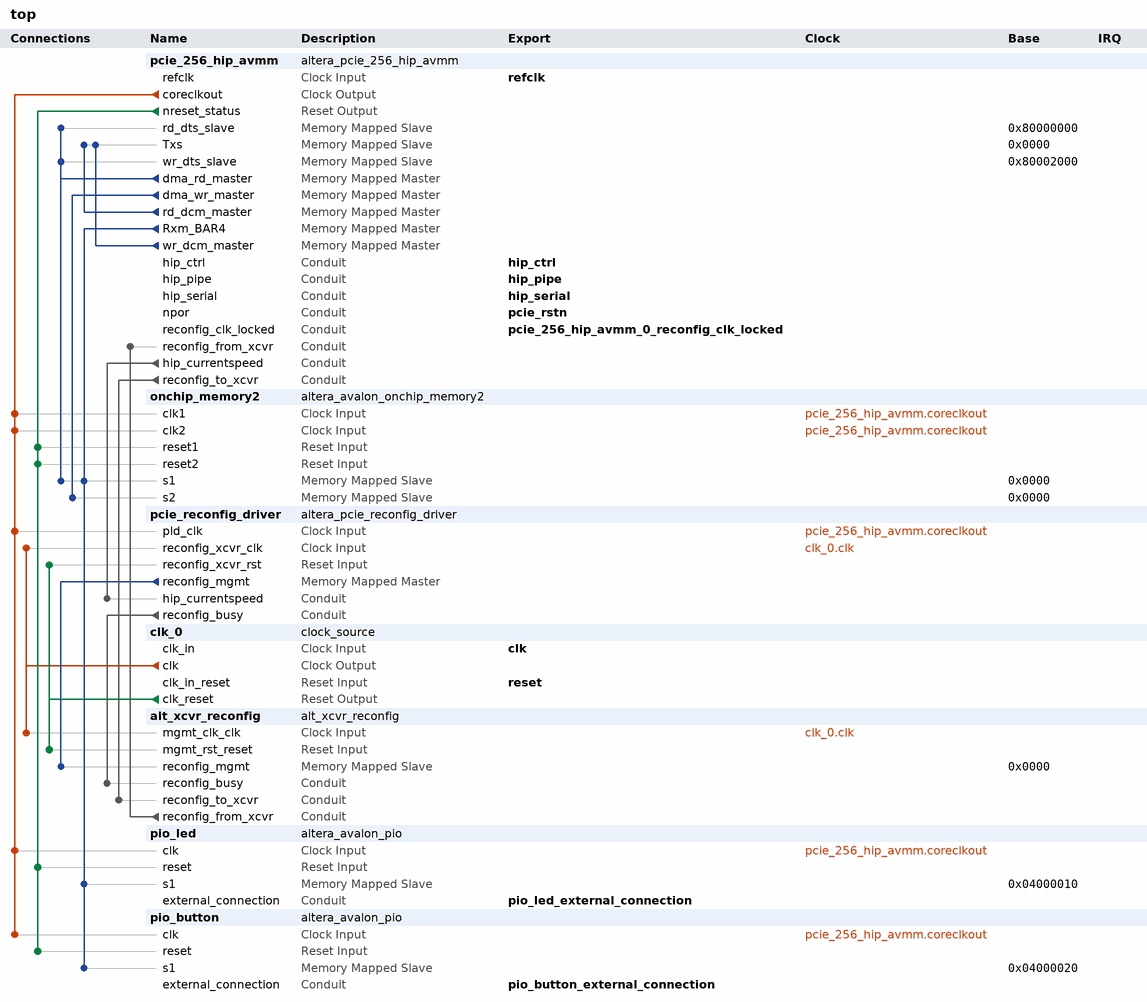
[diagram p0: system contents]
# Platform Designer (Qsys) system top, Cyclone V 5CGTFD9D5F27C7
# Parameters at their usual value, and those the tool derives, are not listed.
package require -exact qsys 17.1
create_system top
set_project_property DEVICE_FAMILY {Cyclone V}
set_project_property DEVICE 5CGTFD9D5F27C7

add_instance pcie_256_hip_avmm altera_pcie_256_hip_avmm 17.1
set_instance_parameter_value pcie_256_hip_avmm CB_P2A_AVALON_ADDR_B0 0x00000000
set_instance_parameter_value pcie_256_hip_avmm CB_P2A_AVALON_ADDR_B1 0x00000000
set_instance_parameter_value pcie_256_hip_avmm CB_P2A_AVALON_ADDR_B2 0x00000000
set_instance_parameter_value pcie_256_hip_avmm CB_P2A_AVALON_ADDR_B3 0x00000000
set_instance_parameter_value pcie_256_hip_avmm CB_P2A_AVALON_ADDR_B4 0x00000000
set_instance_parameter_value pcie_256_hip_avmm CB_P2A_AVALON_ADDR_B5 0x00000000
set_instance_parameter_value pcie_256_hip_avmm CB_P2A_FIXED_AVALON_ADDR_B0 0
set_instance_parameter_value pcie_256_hip_avmm CB_P2A_FIXED_AVALON_ADDR_B1 0
set_instance_parameter_value pcie_256_hip_avmm CB_P2A_FIXED_AVALON_ADDR_B2 0
set_instance_parameter_value pcie_256_hip_avmm CB_P2A_FIXED_AVALON_ADDR_B3 0
set_instance_parameter_value pcie_256_hip_avmm CB_P2A_FIXED_AVALON_ADDR_B4 0
set_instance_parameter_value pcie_256_hip_avmm CB_P2A_FIXED_AVALON_ADDR_B5 0
set_instance_parameter_value pcie_256_hip_avmm CG_COMMON_CLOCK_MODE 1
set_instance_parameter_value pcie_256_hip_avmm CG_RXM_IRQ_NUM 16
set_instance_parameter_value pcie_256_hip_avmm NUM_PREFETCH_MASTERS 1
set_instance_parameter_value pcie_256_hip_avmm RD_SLAVE_ADDRESS_MAP 32
set_instance_parameter_value pcie_256_hip_avmm SLAVE_ADDRESS_MAP_0 0
set_instance_parameter_value pcie_256_hip_avmm SLAVE_ADDRESS_MAP_1 0
set_instance_parameter_value pcie_256_hip_avmm SLAVE_ADDRESS_MAP_2 0
set_instance_parameter_value pcie_256_hip_avmm SLAVE_ADDRESS_MAP_3 0
set_instance_parameter_value pcie_256_hip_avmm SLAVE_ADDRESS_MAP_4 27
set_instance_parameter_value pcie_256_hip_avmm SLAVE_ADDRESS_MAP_5 0
set_instance_parameter_value pcie_256_hip_avmm TX_S_ADDR_WIDTH 64
set_instance_parameter_value pcie_256_hip_avmm WR_SLAVE_ADDRESS_MAP 19
set_instance_parameter_value pcie_256_hip_avmm add_pll_to_hip_coreclkout 0
set_instance_parameter_value pcie_256_hip_avmm advanced_default_hwtcl_atomic_malformed true
set_instance_parameter_value pcie_256_hip_avmm advanced_default_hwtcl_atomic_op_completer_32bit false
set_instance_parameter_value pcie_256_hip_avmm advanced_default_hwtcl_atomic_op_completer_64bit false
set_instance_parameter_value pcie_256_hip_avmm advanced_default_hwtcl_atomic_op_routing false
set_instance_parameter_value pcie_256_hip_avmm advanced_default_hwtcl_bridge_port_ssid_support false
set_instance_parameter_value pcie_256_hip_avmm advanced_default_hwtcl_bridge_port_vga_enable false
set_instance_parameter_value pcie_256_hip_avmm advanced_default_hwtcl_bypass_cdc false
set_instance_parameter_value pcie_256_hip_avmm advanced_default_hwtcl_cas_completer_128bit false
set_instance_parameter_value pcie_256_hip_avmm advanced_default_hwtcl_cdc_dummy_insert_limit 11
set_instance_parameter_value pcie_256_hip_avmm advanced_default_hwtcl_d0_pme false
set_instance_parameter_value pcie_256_hip_avmm advanced_default_hwtcl_d1_pme false
set_instance_parameter_value pcie_256_hip_avmm advanced_default_hwtcl_d1_support false
set_instance_parameter_value pcie_256_hip_avmm advanced_default_hwtcl_d2_pme false
set_instance_parameter_value pcie_256_hip_avmm advanced_default_hwtcl_d2_support false
set_instance_parameter_value pcie_256_hip_avmm advanced_default_hwtcl_d3_cold_pme false
set_instance_parameter_value pcie_256_hip_avmm advanced_default_hwtcl_d3_hot_pme false
set_instance_parameter_value pcie_256_hip_avmm advanced_default_hwtcl_data_pack_rx disable
set_instance_parameter_value pcie_256_hip_avmm advanced_default_hwtcl_deskew_comma com_deskw
set_instance_parameter_value pcie_256_hip_avmm advanced_default_hwtcl_device_number 0
set_instance_parameter_value pcie_256_hip_avmm advanced_default_hwtcl_disable_link_x2_support false
set_instance_parameter_value pcie_256_hip_avmm advanced_default_hwtcl_disable_snoop_packet false
set_instance_parameter_value pcie_256_hip_avmm advanced_default_hwtcl_ei_delay_powerdown_count 10
set_instance_parameter_value pcie_256_hip_avmm advanced_default_hwtcl_eie_before_nfts_count 4
set_instance_parameter_value pcie_256_hip_avmm advanced_default_hwtcl_enable_adapter_half_rate_mode false
set_instance_parameter_value pcie_256_hip_avmm advanced_default_hwtcl_enable_l1_aspm false
set_instance_parameter_value pcie_256_hip_avmm advanced_default_hwtcl_enable_rx_buffer_checking false
set_instance_parameter_value pcie_256_hip_avmm advanced_default_hwtcl_extended_format_field false
set_instance_parameter_value pcie_256_hip_avmm advanced_default_hwtcl_extended_tag_reset false
set_instance_parameter_value pcie_256_hip_avmm advanced_default_hwtcl_fc_init_timer 1024
set_instance_parameter_value pcie_256_hip_avmm advanced_default_hwtcl_flow_control_timeout_count 200
set_instance_parameter_value pcie_256_hip_avmm advanced_default_hwtcl_flow_control_update_count 30
set_instance_parameter_value pcie_256_hip_avmm advanced_default_hwtcl_flr_capability false
set_instance_parameter_value pcie_256_hip_avmm advanced_default_hwtcl_gen2_diffclock_nfts_count 255
set_instance_parameter_value pcie_256_hip_avmm advanced_default_hwtcl_gen2_sameclock_nfts_count 255
set_instance_parameter_value pcie_256_hip_avmm advanced_default_hwtcl_hot_plug_support 0
set_instance_parameter_value pcie_256_hip_avmm advanced_default_hwtcl_interrupt_pin inta
set_instance_parameter_value pcie_256_hip_avmm advanced_default_hwtcl_l01_entry_latency 31
set_instance_parameter_value pcie_256_hip_avmm advanced_default_hwtcl_l0_exit_latency_diffclock 6
set_instance_parameter_value pcie_256_hip_avmm advanced_default_hwtcl_l0_exit_latency_sameclock 6
set_instance_parameter_value pcie_256_hip_avmm advanced_default_hwtcl_l1_exit_latency_diffclock 0
set_instance_parameter_value pcie_256_hip_avmm advanced_default_hwtcl_l1_exit_latency_sameclock 0
set_instance_parameter_value pcie_256_hip_avmm advanced_default_hwtcl_low_priority_vc single_vc
set_instance_parameter_value pcie_256_hip_avmm advanced_default_hwtcl_ltr_mechanism false
set_instance_parameter_value pcie_256_hip_avmm advanced_default_hwtcl_ltssm_1ms_timeout disable
set_instance_parameter_value pcie_256_hip_avmm advanced_default_hwtcl_ltssm_freqlocked_check disable
set_instance_parameter_value pcie_256_hip_avmm advanced_default_hwtcl_maximum_current 0
set_instance_parameter_value pcie_256_hip_avmm advanced_default_hwtcl_no_command_completed false
set_instance_parameter_value pcie_256_hip_avmm advanced_default_hwtcl_no_soft_reset false
set_instance_parameter_value pcie_256_hip_avmm advanced_default_hwtcl_pclk_out_sel pclk
set_instance_parameter_value pcie_256_hip_avmm advanced_default_hwtcl_pipex1_debug_sel disable
set_instance_parameter_value pcie_256_hip_avmm advanced_default_hwtcl_register_pipe_signals false
set_instance_parameter_value pcie_256_hip_avmm advanced_default_hwtcl_reserved_debug 0
set_instance_parameter_value pcie_256_hip_avmm advanced_default_hwtcl_retry_buffer_last_active_address 2047
set_instance_parameter_value pcie_256_hip_avmm advanced_default_hwtcl_rx_l0s_count_idl 0
set_instance_parameter_value pcie_256_hip_avmm advanced_default_hwtcl_set_l0s 0
set_instance_parameter_value pcie_256_hip_avmm advanced_default_hwtcl_skp_os_gen3_count 0
set_instance_parameter_value pcie_256_hip_avmm advanced_default_hwtcl_skp_os_schedule_count 0
set_instance_parameter_value pcie_256_hip_avmm advanced_default_hwtcl_ssid 0
set_instance_parameter_value pcie_256_hip_avmm advanced_default_hwtcl_ssvid 0
set_instance_parameter_value pcie_256_hip_avmm advanced_default_hwtcl_tph_completer false
set_instance_parameter_value pcie_256_hip_avmm advanced_default_hwtcl_tx_cdc_almost_empty 5
set_instance_parameter_value pcie_256_hip_avmm advanced_default_hwtcl_vc0_clk_enable true
set_instance_parameter_value pcie_256_hip_avmm advanced_default_hwtcl_wrong_device_id disable
set_instance_parameter_value pcie_256_hip_avmm advanced_default_parameter_override 0
set_instance_parameter_value pcie_256_hip_avmm altpcie_avmm_hwtcl 1
set_instance_parameter_value pcie_256_hip_avmm app_interface_width_hwtcl 128
set_instance_parameter_value pcie_256_hip_avmm av_rpre_emph_a_val_hwtcl 12
set_instance_parameter_value pcie_256_hip_avmm av_rpre_emph_b_val_hwtcl 0
set_instance_parameter_value pcie_256_hip_avmm av_rpre_emph_c_val_hwtcl 19
set_instance_parameter_value pcie_256_hip_avmm av_rpre_emph_d_val_hwtcl 13
set_instance_parameter_value pcie_256_hip_avmm av_rpre_emph_e_val_hwtcl 21
set_instance_parameter_value pcie_256_hip_avmm av_rvod_sel_a_val_hwtcl 42
set_instance_parameter_value pcie_256_hip_avmm av_rvod_sel_b_val_hwtcl 30
set_instance_parameter_value pcie_256_hip_avmm av_rvod_sel_c_val_hwtcl 43
set_instance_parameter_value pcie_256_hip_avmm av_rvod_sel_d_val_hwtcl 43
set_instance_parameter_value pcie_256_hip_avmm av_rvod_sel_e_val_hwtcl 9
set_instance_parameter_value pcie_256_hip_avmm avmm_width_hwtcl 256
set_instance_parameter_value pcie_256_hip_avmm bar0_type_hwtcl 64
set_instance_parameter_value pcie_256_hip_avmm bar1_type_hwtcl 1
set_instance_parameter_value pcie_256_hip_avmm bar2_type_hwtcl 1
set_instance_parameter_value pcie_256_hip_avmm bar3_type_hwtcl 1
set_instance_parameter_value pcie_256_hip_avmm bar4_type_hwtcl 64
set_instance_parameter_value pcie_256_hip_avmm bar5_type_hwtcl 1
set_instance_parameter_value pcie_256_hip_avmm cdc_dummy_insert_limit_advanced_default_hwtcl 11
set_instance_parameter_value pcie_256_hip_avmm class_code_hwtcl 0
set_instance_parameter_value pcie_256_hip_avmm completion_timeout_hwtcl NONE
set_instance_parameter_value pcie_256_hip_avmm cv_rpre_emph_a_val_hwtcl 11
set_instance_parameter_value pcie_256_hip_avmm cv_rpre_emph_b_val_hwtcl 0
set_instance_parameter_value pcie_256_hip_avmm cv_rpre_emph_c_val_hwtcl 22
set_instance_parameter_value pcie_256_hip_avmm cv_rpre_emph_d_val_hwtcl 12
set_instance_parameter_value pcie_256_hip_avmm cv_rpre_emph_e_val_hwtcl 21
set_instance_parameter_value pcie_256_hip_avmm cv_rvod_sel_a_val_hwtcl 50
set_instance_parameter_value pcie_256_hip_avmm cv_rvod_sel_b_val_hwtcl 34
set_instance_parameter_value pcie_256_hip_avmm cv_rvod_sel_c_val_hwtcl 50
set_instance_parameter_value pcie_256_hip_avmm cv_rvod_sel_d_val_hwtcl 50
set_instance_parameter_value pcie_256_hip_avmm cv_rvod_sel_e_val_hwtcl 9
set_instance_parameter_value pcie_256_hip_avmm d0_pme_advanced_default_hwtcl false
set_instance_parameter_value pcie_256_hip_avmm d1_pme_advanced_default_hwtcl false
set_instance_parameter_value pcie_256_hip_avmm d1_support_advanced_default_hwtcl false
set_instance_parameter_value pcie_256_hip_avmm d2_pme_advanced_default_hwtcl false
set_instance_parameter_value pcie_256_hip_avmm d2_support_advanced_default_hwtcl false
set_instance_parameter_value pcie_256_hip_avmm d3_cold_pme_advanced_default_hwtcl false
set_instance_parameter_value pcie_256_hip_avmm d3_hot_pme_advanced_default_hwtcl false
set_instance_parameter_value pcie_256_hip_avmm deemphasis_enable_advanced_default_hwtcl false
set_instance_parameter_value pcie_256_hip_avmm device_id_hwtcl 57347
set_instance_parameter_value pcie_256_hip_avmm device_number_advanced_default_hwtcl 0
set_instance_parameter_value pcie_256_hip_avmm diffclock_nfts_count_advanced_default_hwtcl 255
set_instance_parameter_value pcie_256_hip_avmm disable_link_x2_support_advanced_default_hwtcl false
set_instance_parameter_value pcie_256_hip_avmm dll_active_report_support_hwtcl 0
set_instance_parameter_value pcie_256_hip_avmm dma_use_scfifo_ext_hwtcl 0
set_instance_parameter_value pcie_256_hip_avmm ecrc_check_capable_hwtcl 0
set_instance_parameter_value pcie_256_hip_avmm ecrc_gen_capable_hwtcl 0
set_instance_parameter_value pcie_256_hip_avmm ei_delay_powerdown_count_advanced_default_hwtcl 10
set_instance_parameter_value pcie_256_hip_avmm eie_before_nfts_count_advanced_default_hwtcl 4
set_instance_parameter_value pcie_256_hip_avmm enable_completion_timeout_disable_hwtcl 1
set_instance_parameter_value pcie_256_hip_avmm enable_cra_hwtcl 1
set_instance_parameter_value pcie_256_hip_avmm enable_function_msix_support_hwtcl 0
set_instance_parameter_value pcie_256_hip_avmm enable_l1_aspm_advanced_default_hwtcl false
set_instance_parameter_value pcie_256_hip_avmm enable_pcisigtest_hwtcl 0
set_instance_parameter_value pcie_256_hip_avmm enable_power_on_rst_pulse_hwtcl 0
set_instance_parameter_value pcie_256_hip_avmm enable_rx_buffer_checking_advanced_default_hwtcl false
set_instance_parameter_value pcie_256_hip_avmm enable_rxm_burst_hwtcl 0
set_instance_parameter_value pcie_256_hip_avmm enable_slot_register_hwtcl 0
set_instance_parameter_value pcie_256_hip_avmm enable_tl_only_sim_hwtcl 0
set_instance_parameter_value pcie_256_hip_avmm endpoint_l0_latency_hwtcl 0
set_instance_parameter_value pcie_256_hip_avmm endpoint_l1_latency_hwtcl 0
set_instance_parameter_value pcie_256_hip_avmm expansion_base_address_register_hwtcl 0
set_instance_parameter_value pcie_256_hip_avmm extend_tag_field_hwtcl 32
set_instance_parameter_value pcie_256_hip_avmm fc_init_timer_advanced_default_hwtcl 1024
set_instance_parameter_value pcie_256_hip_avmm fixed_address_mode 0
set_instance_parameter_value pcie_256_hip_avmm flow_control_timeout_count_advanced_default_hwtcl 200
set_instance_parameter_value pcie_256_hip_avmm flow_control_update_count_advanced_default_hwtcl 30
set_instance_parameter_value pcie_256_hip_avmm force_hrc 0
set_instance_parameter_value pcie_256_hip_avmm force_src 0
set_instance_parameter_value pcie_256_hip_avmm gen123_lane_rate_mode_hwtcl {Gen2 (5.0 Gbps)}
set_instance_parameter_value pcie_256_hip_avmm gen2_diffclock_nfts_count_advanced_default_hwtcl 255
set_instance_parameter_value pcie_256_hip_avmm gen2_sameclock_nfts_count_advanced_default_hwtcl 255
set_instance_parameter_value pcie_256_hip_avmm gen3_rxfreqlock_counter_hwtcl 0
set_instance_parameter_value pcie_256_hip_avmm generate_sdc_for_qsys_design_example 0
set_instance_parameter_value pcie_256_hip_avmm hip_reconfig_hwtcl 0
set_instance_parameter_value pcie_256_hip_avmm hip_tag_checking_hwtcl 1
set_instance_parameter_value pcie_256_hip_avmm hot_plug_support_advanced_default_hwtcl 0
set_instance_parameter_value pcie_256_hip_avmm hwtcl_override_g2_txvod 1
set_instance_parameter_value pcie_256_hip_avmm in_cvp_mode_hwtcl 0
set_instance_parameter_value pcie_256_hip_avmm indicator_advanced_default_hwtcl 0
set_instance_parameter_value pcie_256_hip_avmm internal_controller_hwtcl 1
set_instance_parameter_value pcie_256_hip_avmm io_window_addr_width_hwtcl 0
set_instance_parameter_value pcie_256_hip_avmm l01_entry_latency_advanced_default_hwtcl 31
set_instance_parameter_value pcie_256_hip_avmm l0_exit_latency_diffclock_advanced_default_hwtcl 6
set_instance_parameter_value pcie_256_hip_avmm l0_exit_latency_sameclock_advanced_default_hwtcl 6
set_instance_parameter_value pcie_256_hip_avmm l1_exit_latency_diffclock_advanced_default_hwtcl 0
set_instance_parameter_value pcie_256_hip_avmm l1_exit_latency_sameclock_advanced_default_hwtcl 0
set_instance_parameter_value pcie_256_hip_avmm l2_async_logic_advanced_default_hwtcl disable
set_instance_parameter_value pcie_256_hip_avmm lane_mask_hwtcl x4
set_instance_parameter_value pcie_256_hip_avmm low_priority_vc_advanced_default_hwtcl single_vc
set_instance_parameter_value pcie_256_hip_avmm max_payload_size_hwtcl 256
set_instance_parameter_value pcie_256_hip_avmm msi_64bit_addressing_capable_hwtcl true
set_instance_parameter_value pcie_256_hip_avmm msi_masking_capable_hwtcl false
set_instance_parameter_value pcie_256_hip_avmm msi_multi_message_capable_hwtcl 1
set_instance_parameter_value pcie_256_hip_avmm msi_support_hwtcl true
set_instance_parameter_value pcie_256_hip_avmm msix_pba_bir_hwtcl 0
set_instance_parameter_value pcie_256_hip_avmm msix_pba_offset_hwtcl 0
set_instance_parameter_value pcie_256_hip_avmm msix_table_bir_hwtcl 0
set_instance_parameter_value pcie_256_hip_avmm msix_table_offset_hwtcl 0
set_instance_parameter_value pcie_256_hip_avmm msix_table_size_hwtcl 0
set_instance_parameter_value pcie_256_hip_avmm no_command_completed_advanced_default_hwtcl false
set_instance_parameter_value pcie_256_hip_avmm no_soft_reset_advanced_default_hwtcl false
set_instance_parameter_value pcie_256_hip_avmm override_rxbuffer_cred_preset 0
set_instance_parameter_value pcie_256_hip_avmm override_tbpartner_driver_setting_hwtcl 0
set_instance_parameter_value pcie_256_hip_avmm pcie_inspector_hwtcl 0
set_instance_parameter_value pcie_256_hip_avmm pcie_qsys 1
set_instance_parameter_value pcie_256_hip_avmm pclk_out_sel_advanced_default_hwtcl pclk
set_instance_parameter_value pcie_256_hip_avmm pipex1_debug_sel_advanced_default_hwtcl disable
set_instance_parameter_value pcie_256_hip_avmm pll_refclk_freq_hwtcl {100 MHz}
set_instance_parameter_value pcie_256_hip_avmm port_link_number_hwtcl 1
set_instance_parameter_value pcie_256_hip_avmm port_type_hwtcl {Native endpoint}
set_instance_parameter_value pcie_256_hip_avmm prefetchable_mem_window_addr_width_hwtcl 0
set_instance_parameter_value pcie_256_hip_avmm register_pipe_signals_advanced_default_hwtcl true
set_instance_parameter_value pcie_256_hip_avmm reserved_debug_advanced_default_hwtcl 0
set_instance_parameter_value pcie_256_hip_avmm retry_buffer_last_active_address_advanced_default_hwtcl 255
set_instance_parameter_value pcie_256_hip_avmm revision_id_hwtcl 1
set_instance_parameter_value pcie_256_hip_avmm rpre_emph_a_val_hwtcl 9
set_instance_parameter_value pcie_256_hip_avmm rpre_emph_b_val_hwtcl 0
set_instance_parameter_value pcie_256_hip_avmm rpre_emph_c_val_hwtcl 16
set_instance_parameter_value pcie_256_hip_avmm rpre_emph_d_val_hwtcl 13
set_instance_parameter_value pcie_256_hip_avmm rpre_emph_e_val_hwtcl 5
set_instance_parameter_value pcie_256_hip_avmm rvod_sel_a_val_hwtcl 42
set_instance_parameter_value pcie_256_hip_avmm rvod_sel_b_val_hwtcl 38
set_instance_parameter_value pcie_256_hip_avmm rvod_sel_c_val_hwtcl 38
set_instance_parameter_value pcie_256_hip_avmm rvod_sel_d_val_hwtcl 43
set_instance_parameter_value pcie_256_hip_avmm rvod_sel_e_val_hwtcl 15
set_instance_parameter_value pcie_256_hip_avmm rx_cdc_almost_full_advanced_default_hwtcl 12
set_instance_parameter_value pcie_256_hip_avmm rx_l0s_count_idl_advanced_default_hwtcl 0
set_instance_parameter_value pcie_256_hip_avmm rxbuffer_rxreq_hwtcl Low
set_instance_parameter_value pcie_256_hip_avmm sameclock_nfts_count_advanced_default_hwtcl 255
set_instance_parameter_value pcie_256_hip_avmm serial_sim_hwtcl 1
set_instance_parameter_value pcie_256_hip_avmm set_pld_clk_x1_625MHz_hwtcl 0
set_instance_parameter_value pcie_256_hip_avmm set_pll_coreclkout_slack 10
set_instance_parameter_value pcie_256_hip_avmm skp_os_schedule_count_advanced_default_hwtcl 0
set_instance_parameter_value pcie_256_hip_avmm slot_number_hwtcl 0
set_instance_parameter_value pcie_256_hip_avmm slot_power_limit_hwtcl 0
set_instance_parameter_value pcie_256_hip_avmm slot_power_scale_hwtcl 0
set_instance_parameter_value pcie_256_hip_avmm slotclkcfg_hwtcl 1
set_instance_parameter_value pcie_256_hip_avmm subsystem_device_id_hwtcl 13409
set_instance_parameter_value pcie_256_hip_avmm subsystem_vendor_id_hwtcl 4369
set_instance_parameter_value pcie_256_hip_avmm surprise_down_error_support_hwtcl 0
set_instance_parameter_value pcie_256_hip_avmm tlp_insp_trg_dw0_hwtcl 2049
set_instance_parameter_value pcie_256_hip_avmm tlp_insp_trg_dw1_hwtcl 0
set_instance_parameter_value pcie_256_hip_avmm tlp_insp_trg_dw2_hwtcl 0
set_instance_parameter_value pcie_256_hip_avmm tlp_insp_trg_dw3_hwtcl 0
set_instance_parameter_value pcie_256_hip_avmm tlp_inspector_hwtcl 0
set_instance_parameter_value pcie_256_hip_avmm tlp_inspector_use_signal_probe_hwtcl 0
set_instance_parameter_value pcie_256_hip_avmm tx_cdc_almost_empty_advanced_default_hwtcl 5
set_instance_parameter_value pcie_256_hip_avmm tx_cdc_almost_full_advanced_default_hwtcl 11
set_instance_parameter_value pcie_256_hip_avmm use_aer_hwtcl 0
set_instance_parameter_value pcie_256_hip_avmm use_ast_parity 0
set_instance_parameter_value pcie_256_hip_avmm use_atx_pll_hwtcl 0
set_instance_parameter_value pcie_256_hip_avmm use_crc_forwarding_hwtcl 0
set_instance_parameter_value pcie_256_hip_avmm use_cvp_update_core_pof_hwtcl 0
set_instance_parameter_value pcie_256_hip_avmm use_rx_st_be_hwtcl 0
set_instance_parameter_value pcie_256_hip_avmm use_tl_cfg_sync_advanced_default_hwtcl 1
set_instance_parameter_value pcie_256_hip_avmm vc0_clk_enable_advanced_default_hwtcl true
set_instance_parameter_value pcie_256_hip_avmm vendor_id_hwtcl 4466
set_instance_parameter_value pcie_256_hip_avmm vsec_id_hwtcl 40960
set_instance_parameter_value pcie_256_hip_avmm vsec_rev_hwtcl 0

add_instance onchip_memory2 altera_avalon_onchip_memory2 17.1
set_instance_parameter_value onchip_memory2 dataWidth 128
set_instance_parameter_value onchip_memory2 dualPort true
set_instance_parameter_value onchip_memory2 initMemContent false
set_instance_parameter_value onchip_memory2 initializationFileName onchip_mem.hex
set_instance_parameter_value onchip_memory2 memorySize 524288

add_instance pcie_reconfig_driver altera_pcie_reconfig_driver 17.1
set_instance_parameter_value pcie_reconfig_driver gen123_lane_rate_mode_hwtcl {Gen2 (5.0 Gbps)}
set_instance_parameter_value pcie_reconfig_driver number_of_reconfig_interfaces 5

add_instance clk_0 clock_source 17.1
set_instance_parameter_value clk_0 clockFrequency 50000000

add_instance alt_xcvr_reconfig alt_xcvr_reconfig 17.1
set_instance_parameter_value alt_xcvr_reconfig device_family {Cyclone V}
set_instance_parameter_value alt_xcvr_reconfig enable_adce 0
set_instance_parameter_value alt_xcvr_reconfig enable_analog 1
set_instance_parameter_value alt_xcvr_reconfig number_of_reconfig_interfaces 5

add_instance pio_led altera_avalon_pio 17.1
set_instance_parameter_value pio_led direction Output
set_instance_parameter_value pio_led width 4

add_instance pio_button altera_avalon_pio 17.1
set_instance_parameter_value pio_button direction Input
set_instance_parameter_value pio_button width 4

# connections
add_connection clk_0.clk alt_xcvr_reconfig.mgmt_clk_clk clock
add_connection clk_0.clk pcie_reconfig_driver.reconfig_xcvr_clk clock
add_connection pcie_256_hip_avmm.coreclkout onchip_memory2.clk1 clock
add_connection pcie_256_hip_avmm.coreclkout onchip_memory2.clk2 clock
add_connection pcie_256_hip_avmm.coreclkout pcie_reconfig_driver.pld_clk clock
add_connection pcie_256_hip_avmm.coreclkout pio_button.clk clock
add_connection pcie_256_hip_avmm.coreclkout pio_led.clk clock
add_connection clk_0.clk_reset alt_xcvr_reconfig.mgmt_rst_reset reset
add_connection clk_0.clk_reset pcie_reconfig_driver.reconfig_xcvr_rst reset
add_connection pcie_256_hip_avmm.nreset_status onchip_memory2.reset1 reset
add_connection pcie_256_hip_avmm.nreset_status onchip_memory2.reset2 reset
add_connection pcie_256_hip_avmm.nreset_status pio_button.reset reset
add_connection pcie_256_hip_avmm.nreset_status pio_led.reset reset
add_connection pcie_256_hip_avmm.dma_rd_master onchip_memory2.s1 avalon
set_connection_parameter_value pcie_256_hip_avmm.dma_rd_master/onchip_memory2.s1 baseAddress 0x0000
add_connection pcie_256_hip_avmm.dma_rd_master pcie_256_hip_avmm.rd_dts_slave avalon
set_connection_parameter_value pcie_256_hip_avmm.dma_rd_master/pcie_256_hip_avmm.rd_dts_slave baseAddress 0x80000000
add_connection pcie_256_hip_avmm.dma_rd_master pcie_256_hip_avmm.wr_dts_slave avalon
set_connection_parameter_value pcie_256_hip_avmm.dma_rd_master/pcie_256_hip_avmm.wr_dts_slave baseAddress 0x80002000
add_connection pcie_256_hip_avmm.dma_wr_master onchip_memory2.s2 avalon
set_connection_parameter_value pcie_256_hip_avmm.dma_wr_master/onchip_memory2.s2 baseAddress 0x0000
add_connection pcie_256_hip_avmm.rd_dcm_master pcie_256_hip_avmm.Txs avalon
set_connection_parameter_value pcie_256_hip_avmm.rd_dcm_master/pcie_256_hip_avmm.Txs baseAddress 0x0000
add_connection pcie_256_hip_avmm.Rxm_BAR4 onchip_memory2.s1 avalon
set_connection_parameter_value pcie_256_hip_avmm.Rxm_BAR4/onchip_memory2.s1 baseAddress 0x0000
add_connection pcie_256_hip_avmm.Rxm_BAR4 pio_button.s1 avalon
set_connection_parameter_value pcie_256_hip_avmm.Rxm_BAR4/pio_button.s1 baseAddress 0x04000020
add_connection pcie_256_hip_avmm.Rxm_BAR4 pio_led.s1 avalon
set_connection_parameter_value pcie_256_hip_avmm.Rxm_BAR4/pio_led.s1 baseAddress 0x04000010
add_connection pcie_256_hip_avmm.wr_dcm_master pcie_256_hip_avmm.Txs avalon
set_connection_parameter_value pcie_256_hip_avmm.wr_dcm_master/pcie_256_hip_avmm.Txs baseAddress 0x0000
add_connection pcie_reconfig_driver.reconfig_mgmt alt_xcvr_reconfig.reconfig_mgmt avalon
set_connection_parameter_value pcie_reconfig_driver.reconfig_mgmt/alt_xcvr_reconfig.reconfig_mgmt baseAddress 0x0000
add_connection alt_xcvr_reconfig.reconfig_from_xcvr pcie_256_hip_avmm.reconfig_from_xcvr conduit
add_connection pcie_256_hip_avmm.hip_currentspeed pcie_reconfig_driver.hip_currentspeed conduit
add_connection pcie_256_hip_avmm.reconfig_to_xcvr alt_xcvr_reconfig.reconfig_to_xcvr conduit
add_connection pcie_reconfig_driver.reconfig_busy alt_xcvr_reconfig.reconfig_busy conduit

# exported interfaces
add_interface clk clock sink
set_interface_property clk EXPORT_OF clk_0.clk_in
add_interface hip_ctrl conduit end
set_interface_property hip_ctrl EXPORT_OF pcie_256_hip_avmm.hip_ctrl
add_interface hip_pipe conduit end
set_interface_property hip_pipe EXPORT_OF pcie_256_hip_avmm.hip_pipe
add_interface hip_serial conduit end
set_interface_property hip_serial EXPORT_OF pcie_256_hip_avmm.hip_serial
add_interface pcie_256_hip_avmm_0_reconfig_clk_locked conduit end
set_interface_property pcie_256_hip_avmm_0_reconfig_clk_locked EXPORT_OF pcie_256_hip_avmm.reconfig_clk_locked
add_interface pcie_rstn conduit end
set_interface_property pcie_rstn EXPORT_OF pcie_256_hip_avmm.npor
add_interface pio_button_external_connection conduit end
set_interface_property pio_button_external_connection EXPORT_OF pio_button.external_connection
add_interface pio_led_external_connection conduit end
set_interface_property pio_led_external_connection EXPORT_OF pio_led.external_connection
add_interface refclk clock sink
set_interface_property refclk EXPORT_OF pcie_256_hip_avmm.refclk
add_interface reset reset sink
set_interface_property reset EXPORT_OF clk_0.clk_in_reset

set_interconnect_requirement {$system} qsys_mm.clockCrossingAdapter HANDSHAKE
set_interconnect_requirement {$system} qsys_mm.enableEccProtection FALSE
set_interconnect_requirement {$system} qsys_mm.insertDefaultSlave FALSE
set_interconnect_requirement {$system} qsys_mm.maxAdditionalLatency 1

save_system top.qsys
